# Altium schematic sheet conn_board_power.SchDoc (part 2 of 2)
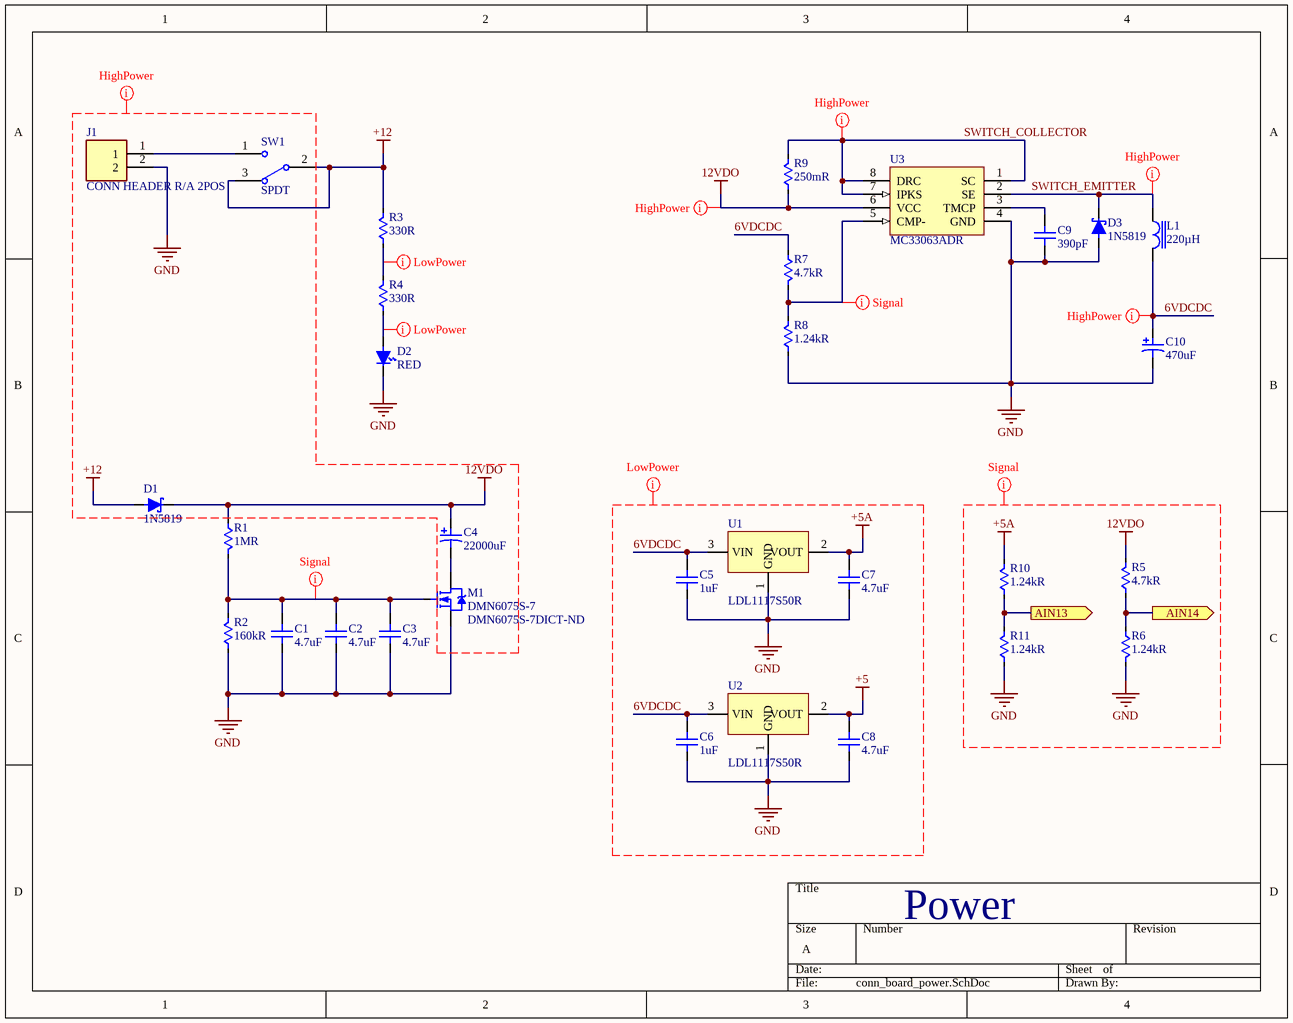
[diagram p1: conn_board_power.SchDoc]

## Library data of the parts (continued)
U3 = MC33063ADR: 1.5-A peak boost/buck/inverting switching regulator 8-SOIC -40 to 85; Manufacturer: Texas Instruments; Number of Outputs: 1; Output Current: 1.5A; Output Voltage: 40V; Switching Frequency: 100kHz; Min Input Voltage: 3V; Synchronous Rectifier: No; Output Type: Adjustable; Max Output Current: 750mA; Min Output Voltage: 1.25V; Quiescent Current: 4mA; Topology: Flyback; Supplier 1: Digi-Key; Manufacturer Part Number: MC33063ADR; Category: IC; Stock 1: 130093; Pricing 1: 1=0.44000, 10=0.37500, 25=0.35000, 100=0.26000, 250=0.22000, 500=0.21000, 1000=0.15500 (USD); Case/Package: D; Number of Pins: 8; Weight: 0.002561oz; Contact Plating: Gold; Min Operating Temperature: -40°C; Max Operating Temperature: 85°C; Packaging: Tape and Reel; Package Quantity: 1; Max Input Voltage: 40V; Max Output Voltage: 40V; Termination: SMD/SMT; Lead Free: Lead Free; REACH SVHC: No SVHC; ComponentLink1URL: https://datasheet.ciiva.com/41462/001014422-da-01-en-ic-reg-buck-boost-mc33063adr-soic-8-tid-41462284.pdf?src-supplier=Conrad; ComponentLink1Description: https://datasheet.ciiva.com/41462/001014422-da-01-en-ic-reg-buck-boost-mc33063adr-soic-8-tid-41462284.pdf?src-supplier=Conrad; ComponentLink2URL: https://datasheet.ciiva.com/26897/mc33063adr-26897702.pdf?src-supplier=IIIC; ComponentLink2Description: https://datasheet.ciiva.com/26897/mc33063adr-26897702.pdf?src-supplier=IIIC; ComponentLink3URL: https://datasheet.ciiva.com/7993/1862376-7993641.pdf?src-supplier=Element14; ComponentLink3Description: https://datasheet.ciiva.com/7993/1862376-7993641.pdf?src-supplier=Element14; ComponentLink4URL: https://datasheet.ciiva.com/7408/1862376-7408058.pdf?src-supplier=Newark; ComponentLink4Description: https://datasheet.ciiva.com/7408/1862376-7408058.pdf?src-supplier=Newark; ComponentLink5URL: https://datasheet.ciiva.com/46419/1803417-46419179.pdf?src-supplier=Element14; ComponentLink5Description: https://datasheet.ciiva.com/46419/1803417-46419179.pdf?src-supplier=Element14; ComponentLink6URL: https://datasheet.ciiva.com/2025/mc33063a-2025164.pdf?src-supplier=Digi-Key; ComponentLink6Description: https://datasheet.ciiva.com/2025/mc33063a-2025164.pdf?src-supplier=Digi-Key; ComponentLink7URL: https://datasheet.ciiva.com/2025/mc33063a-2025165.pdf?src-supplier=Digi-Key; ComponentLink7Description: https://datasheet.ciiva.com/2025/mc33063a-2025165.pdf?src-supplier=Digi-Key; ComponentLink8URL: https://datasheet.ciiva.com/2025/mc33063a-2025166.pdf?src-supplier=Digi-Key; ComponentLink8Description: https://datasheet.ciiva.com/2025/mc33063a-2025166.pdf?src-supplier=Digi-Key; ComponentLink9URL: https://octopart.com/click/track?ai=8629&ct=datasheets&sig=0128011&at=physicalpart&sid=370&ppid=525094&hlid=24898548&src-supplier=TI+store; ComponentLink9Description: https://octopart.com/click/track?ai=8629&ct=datasheets&sig=0128011&at=physicalpart&sid=370&ppid=525094&hlid=24898548&src-supplier=TI+store; ComponentLink10URL: http://datasheet.octopart.com/MC33063ADR-Texas-Instruments-datasheet-37140769.pdf?src-supplier=Farnell; ComponentLink10Description: http://datasheet.octopart.com/MC33063ADR-Texas-Instruments-datasheet-37140769.pdf?src-supplier=Farnell; ComponentLink11URL: http://datasheet.octopart.com/MC33063ADR-Texas-Instruments-datasheet-149237.pdf?src-supplier=TI+store; ComponentLink11Description: http://datasheet.octopart.com/MC33063ADR-Texas-Instruments-datasheet-149237.pdf?src-supplier=TI+store; ComponentLink12URL: http://datasheet.octopart.com/MC33063ADR-Texas-Instruments-datasheet-149238.pdf?src-supplier=TI+store; ComponentLink12Description: http://datasheet.octopart.com/MC33063ADR-Texas-Instruments-datasheet-149238.pdf?src-supplier=TI+store; ComponentLink13URL: http://datasheet.octopart.com/MC33063ADR-Texas-Instruments-datasheet-149239.pdf?src-supplier=TI+store; ComponentLink13Description: http://datasheet.octopart.com/MC33063ADR-Texas-Instruments-datasheet-149239.pdf?src-supplier=TI+store; ComponentLink14URL: http://datasheet.octopart.com/MC33063ADR-Texas-Instruments-datasheet-149240.pdf?src-supplier=TI+store; ComponentLink14Description: http://datasheet.octopart.com/MC33063ADR-Texas-Instruments-datasheet-149240.pdf?src-supplier=TI+store; ComponentLink15URL: http://datasheet.octopart.com/MC33063ADR-Texas-Instruments-datasheet-149241.pdf?src-supplier=TI+store; ComponentLink15Description: http://datasheet.octopart.com/MC33063ADR-Texas-Instruments-datasheet-149241.pdf?src-supplier=TI+store; ComponentLink16URL: http://datasheet.octopart.com/MC33063ADR-Texas-Instruments-datasheet-10254267.pdf?src-supplier=TI+store; ComponentLink16Description: http://datasheet.octopart.com/MC33063ADR-Texas-Instruments-datasheet-10254267.pdf?src-supplier=TI+store; ComponentLink17URL: http://sigma.octopart.com/49249642/technical_drawing/Texas-Instruments-MC33063ADR.pdf?src-supplier=TI+store; ComponentLink17Description: http://sigma.octopart.com/49249642/technical_drawing/Texas-Instruments-MC33063ADR.pdf?src-supplier=TI+store; ComponentLink18URL: http://datasheet.octopart.com/MC33063ADR-Texas-Instruments-datasheet-12606816.pdf?src-supplier=Farnell; ComponentLink18Description: http://datasheet.octopart.com/MC33063ADR-Texas-Instruments-datasheet-12606816.pdf?src-supplier=Farnell; ComponentLink19URL: http://datasheet.octopart.com/MC33063ADR-Texas-Instruments-datasheet-81639027.pdf?src-supplier=Farnell; ComponentLink19Description: http://datasheet.octopart.com/MC33063ADR-Texas-Instruments-datasheet-81639027.pdf?src-supplier=Farnell; ComponentLink20URL: http://datasheet.octopart.com/MC33063ADR-Texas-Instruments-datasheet-23714746.pdf?src-supplier=Newark; ComponentLink20Description: http://datasheet.octopart.com/MC33063ADR-Texas-Instruments-datasheet-23714746.pdf?src-supplier=Newark; ComponentLink21URL: http://datasheet.octopart.com/MC33063ADR-Texas-Instruments-datasheet-33038661.pdf?src-supplier=Element14; ComponentLink21Description: http://datasheet.octopart.com/MC33063ADR-Texas-Instruments-datasheet-33038661.pdf?src-supplier=Element14; ComponentLink22URL: http://datasheet.octopart.com/MC33063ADR.-Texas-Instruments-datasheet-58444985.pdf?src-supplier=Element14; ComponentLink22Description: http://datasheet.octopart.com/MC33063ADR.-Texas-Instruments-datasheet-58444985.pdf?src-supplier=Element14; ComponentLink23URL: http://datasheet.octopart.com/MC33063ADR.-Texas-Instruments-datasheet-65572232.pdf?src-supplier=Element14; ComponentLink23Description: http://datasheet.octopart.com/MC33063ADR.-Texas-Instruments-datasheet-65572232.pdf?src-supplier=Element14; ComponentLink24URL: http://datasheet.octopart.com/MC33063ADR-Texas-Instruments-datasheet-12052.pdf?src-supplier=Newark; ComponentLink24Description: http://datasheet.octopart.com/MC33063ADR-Texas-Instruments-datasheet-12052.pdf?src-supplier=Newark; ComponentLink25URL: http://datasheet.octopart.com/MC33063ADR-Texas-Instruments-datasheet-137654.pdf?src-supplier=Digi-Key; ComponentLink25Description: http://datasheet.octopart.com/MC33063ADR-Texas-Instruments-datasheet-137654.pdf?src-supplier=Digi-Key; ComponentLink26URL: http://datasheet.octopart.com/MC33063ADR-Texas-Instruments-datasheet-8883959.pdf?src-supplier=Element14; ComponentLink26Description: http://datasheet.octopart.com/MC33063ADR-Texas-Instruments-datasheet-8883959.pdf?src-supplier=Element14; ComponentLink27URL: http://datasheet.octopart.com/MC33063ADR-Texas-Instruments-datasheet-11768196.pdf?src-supplier=Arrow; ComponentLink27Description: http://datasheet.octopart.com/MC33063ADR-Texas-Instruments-datasheet-11768196.pdf?src-supplier=Arrow; ComponentLink28URL: http://datasheet.octopart.com/MC33063ADR-Texas-Instruments-datasheet-14045796.pdf?src-supplier=IIIC; ComponentLink28Description: http://datasheet.octopart.com/MC33063ADR-Texas-Instruments-datasheet-14045796.pdf?src-supplier=IIIC; Supplier Part Number 1: 296-17763-1-ND